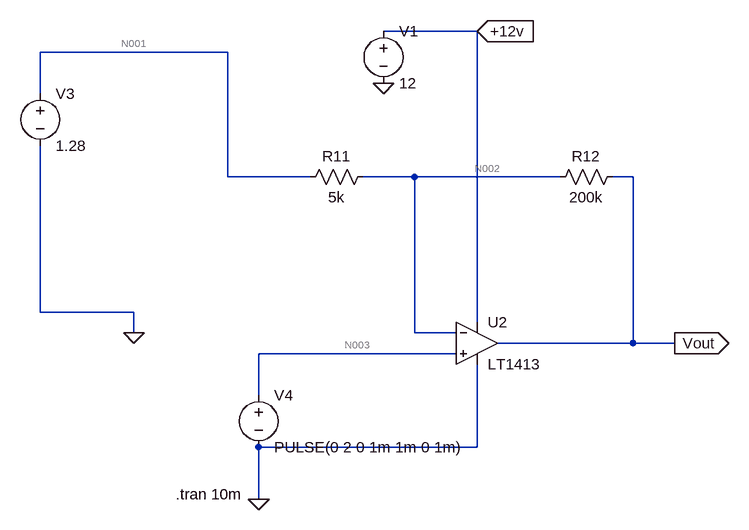
[diagram p0: schematic Draft2.asc]
Draft2.asc, the LTspice schematic file:
Version 4
SHEET 1 1060 680
WIRE -96 -1152 -240 -1152
WIRE -480 -1120 -768 -1120
WIRE -768 -1056 -768 -1120
WIRE -480 -928 -480 -1120
WIRE -352 -928 -480 -928
WIRE -192 -928 -272 -928
WIRE 32 -928 -192 -928
WIRE 144 -928 112 -928
WIRE -768 -720 -768 -976
WIRE -624 -720 -768 -720
WIRE -96 -704 -96 -1152
WIRE -624 -688 -624 -720
WIRE -192 -688 -192 -928
WIRE -128 -688 -192 -688
WIRE 144 -672 144 -928
WIRE 144 -672 -64 -672
WIRE 208 -672 144 -672
WIRE -128 -656 -432 -656
WIRE -432 -592 -432 -656
WIRE -96 -512 -96 -640
WIRE -96 -512 -432 -512
WIRE -432 -432 -432 -512
FLAG -432 -432 0
FLAG 208 -672 Vout
IOPIN 208 -672 Out
FLAG -624 -688 0
FLAG -240 -1072 0
FLAG -96 -1152 +12v
IOPIN -96 -1152 In
SYMBOL res -256 -944 R90
WINDOW 0 0 56 VBottom 2
WINDOW 3 32 56 VTop 2
SYMATTR InstName R11
SYMATTR Value 5k
SYMBOL res 128 -944 R90
WINDOW 0 0 56 VBottom 2
WINDOW 3 32 56 VTop 2
SYMATTR InstName R12
SYMATTR Value 200k
SYMBOL voltage -768 -1072 R0
WINDOW 123 0 0 Left 0
WINDOW 39 0 0 Left 0
SYMATTR InstName V3
SYMATTR Value 1.28
SYMBOL voltage -432 -608 R0
WINDOW 123 0 0 Left 0
WINDOW 39 0 0 Left 0
SYMATTR InstName V4
SYMATTR Value PULSE(0 2 0 1m 1m 0 1m)
SYMBOL voltage -240 -1168 R0
WINDOW 123 0 0 Left 0
WINDOW 39 0 0 Left 0
SYMATTR InstName V1
SYMATTR Value 12
SYMBOL OpAmps\\LT1413 -96 -736 R0
SYMATTR InstName U2
TEXT -560 -440 Left 2 !.tran 10m

The netlist it stands for:
* Draft2.asc
R11 N002 N001 5k
R12 Vout N002 200k
V3 N001 0 1.28
V4 N003 0 PULSE(0 2 0 1m 1m 0 1m)
V1 +12v 0 12
XU2 N003 N002 +12v 0 Vout LT1413  ; pins In+ In- V+ V- OUT
.tran 10m
.lib LTC.lib
.backanno
.end

* Results of the author's LTspice run, read from the files saved beside the schematic
* Operating Point, zero values left out:
*   V(n001) = 1.28 V
*   V(+12v) = 12 V
*   V(n002) = 1.25 V
*   V(vout) = 64.84 mV
*   I(R11) = -5.918 µA
*   I(V1) = -320.4 µA
*   I(V3) = -5.918 µA
*   I(R12) = -5.928 µA
*   I(V4) = 15.48 nA
*   Ix(u2:1) = -15.48 nA
*   Ix(u2:2) = -9.601 nA
*   Ix(u2:3) = 320.4 µA
*   Ix(u2:4) = -324.9 µA
*   Ix(u2:5) = 5.928 µA
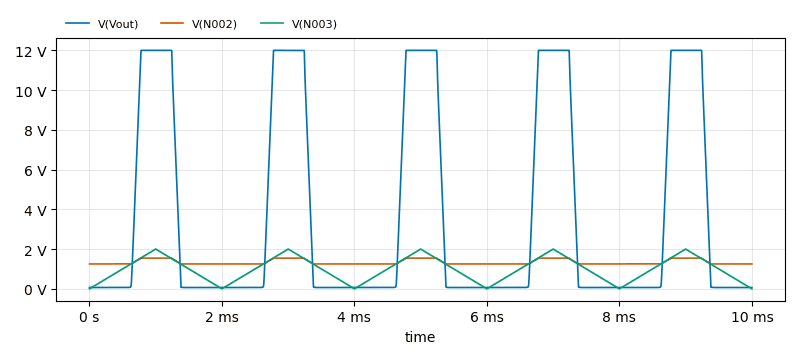
[diagram p1: Transient Analysis of Draft2.asc, plotted from the saved traces]
* Transient Analysis, 1 run:
*   V(Vout): min 64.64 mV, max 12 V, average 3.674 V, rms 6.406 V, last 64.74 mV
*   V(N002): min 1.25 V, max 1.542 V, average 1.338 V, rms 1.345 V, last 1.25 V
*   V(N003): min 0 V, max 2 V, average 1 V, rms 1.177 V, last 0 V